# Altium schematic sheet Control.SchDoc
size Legal; SheetNumber: 1; SheetTotal: 1; SPICEModelCacheVIZEHTWB: <root> / <DocumentId>VIZEHTWB</DocumentId> / <CacheFrame Number="0"> / <Model Name="diode" Kind="MDL"> / <Text>*Default Diode / *Diode Pinout: A,K / .MODEL DIODE D()</Text> / </Model> / </CacheFrame> / </root>
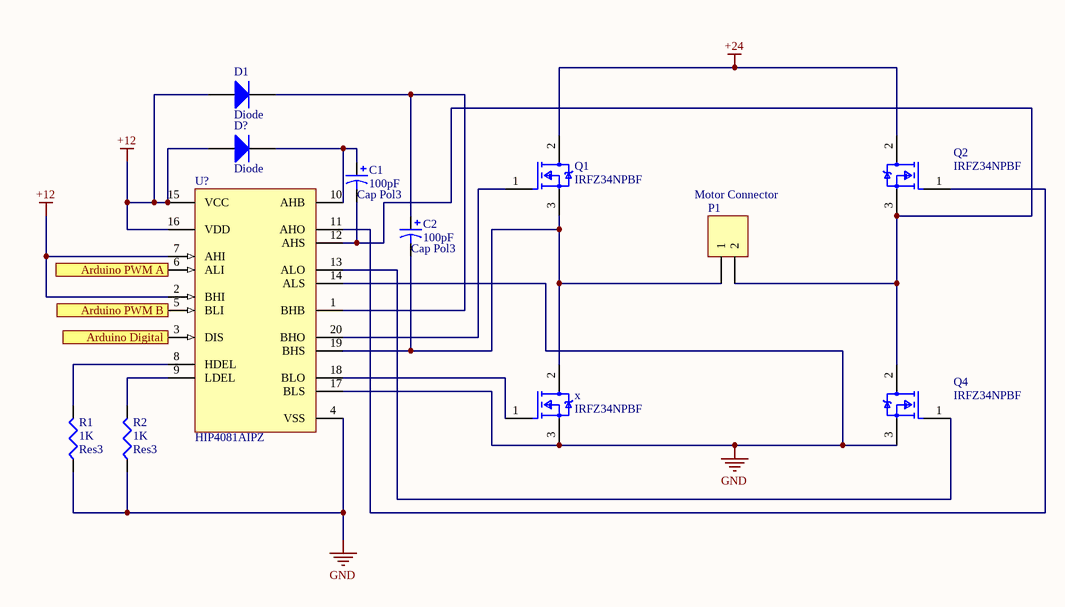
[diagram p0: Control.SchDoc]

## Parts
C1  Cap Pol3  value 100pF  [C0805]
C2  Cap Pol3  value 100pF  [C0805]
D1  Diode  [SMC]
D?  Diode  [SMC]
P1  Motor Connector  [HDR1X2]
Q1  IRFZ34NPBF  [FP-PG-TO220-3-MFG]
Q2  IRFZ34NPBF  [FP-PG-TO220-3-MFG]
Q4  IRFZ34NPBF  [FP-PG-TO220-3-MFG]
R1  Res3  value 1K  [J1-0603]
R2  Res3  value 1K  [J1-0603]
U?  HIP4081AIPZ  [DIP762W46P254L2590H533Q20_E20_3_N]
x  IRFZ34NPBF  [FP-PG-TO220-3-MFG]

## Ports
Arduino Digital (in), Arduino PWM A (in), Arduino PWM B (in)

## Nets
+12: D1.1(A) D?.1(A) U?.2(BHI) U?.7(AHI) U?.15(VCC) U?.16(VDD)
+24: Q1.2(DRAIN) Q2.2(DRAIN)
GND: Q4.3(SOURCE) R1.1 R2.1 U?.4(VSS) U?.14(ALS) U?.17(BLS) x.3(SOURCE)
Arduino Digital: U?.3(DIS) ; port Arduino Digital
Arduino PWM A: U?.6(ALI) ; port Arduino PWM A
Arduino PWM B: U?.5(BLI) ; port Arduino PWM B
NetC1_1: C1.1 D?.2(K) U?.10(AHB)
NetC1_2: C1.2 P1.2 Q2.3(SOURCE) Q4.2(DRAIN) U?.12(AHS)
NetC2_1: C2.1 D1.2(K) U?.1(BHB)
NetC2_2: C2.2 P1.1 Q1.3(SOURCE) U?.19(BHS) x.2(DRAIN)
NetQ1_1: Q1.1(GATE) U?.20(BHO)
NetQ2_1: Q2.1(GATE) U?.11(AHO)
NetQ4_1: Q4.1(GATE) U?.13(ALO)
NetR1_2: R1.2 U?.8(HDEL)
NetR2_2: R2.2 U?.9(LDEL)
NetU?_18: U?.18(BLO) x.1(GATE)

## Library data of the parts
C1 C2 = Cap Pol3: Polarized Capacitor (Surface Mount); Published: 8-Jun-2000; LatestRevisionDate: 29-May-2009; LatestRevisionNote: IPC-7351 Footprint Added.; PackageReference: C0805; Publisher: Altium Limited; PackageDescription: Chip Capacitor
D1 D? = Diode: Default Diode; Published: 8-Jun-2000; LatestRevisionDate: 17-Jul-2002; LatestRevisionNote: Re-released for DXP Platform.; PackageVersion: Sep-1996; PackageReference: SMC; Publisher: Altium Limited; PackageDescription: DO-214-AB/SMC; 2 C-Bend Leads; Body 7.9 x 5.9 mm, inc. leads (LxW); Code_JEDEC: DO-214-AB
P1 = Header 2: Header, 2-Pin; LatestRevisionDate: 17-Jul-2002; LatestRevisionNote: Re-released for DXP Platform.; Publisher: Altium Limited
Q1 Q2 Q4 x = CMP-32901-000547-1: MOSFET N-CH 55V 29A TO220AB; Rise Time: 49ns; Turn-On Delay Time: 7ns; Input Capacitance: 700pF; Drain to Source Resistance: 40mR; Turn-Off Delay Time: 31ns; Power Dissipation: 68W; Gate to Source Voltage (Vgs): 20V; Element Configuration: Single; Threshold Voltage: 4V; Packaging: Rail/Tube; Number of Pins: 3; Height: 0.6inch; Case/Package: TO-220; Min Operating Temperature: -55°C; Max Operating Temperature: 175°C; RoHS Compliant: Yes; Width: 0.185inch; Lead Free: Lead Free; Contact Plating: Tin; Drain to Source Breakdown Voltage: 55V; Length: 0.414inch; Mount: Through Hole; Max Power Dissipation: 68W; Halogen Free: Not Halogen Free; Max Dual Supply Voltage: 55V; Rds On Max: 40mR; Continuous Drain Current (ID): 29A; Drain to Source Voltage (Vdss): 55V; REACH SVHC: No SVHC
R1 R2 = Res3: Resistor; Published: 8-Jun-2000; LatestRevisionDate: 29-May-2009; LatestRevisionNote: IPC-7351 Footprint Added.; PackageReference: J1-0603; Publisher: Altium Limited; PackageDescription: Chip Resistor
U? = CMP-00572-88252434-2: Driver 2.5A 4-OUT Hi/Lo Side Full Brdg/Half Brdg Inv/Non-Inv Automotive 20-Pin PDIP Tube; Manufacturer Lifecycle Status: ACTIVE; Nominal Supply Current: 10.5mA; Max Supply Voltage: 15V; Pitch: 2.5mm; Number of Channels: 4; RAM Size: 32kB; Max Power Dissipation: 440mW; Turn-On Delay Time: 110ns; Fall Time: 10ns; Number of Drivers: 1; Output Voltage: 12.6V; Propagation Delay: 30ns; Overload Protection: Under Voltage; Min Supply Voltage: 9.5V; Turn-Off Delay Time: 90ns; Max Supply Current: 15.5mA; Switching Frequency: 1MHz; Number of Pins: 20; ComponentLink2Description: Datasheet URL; ComponentLink1Description: Manufacturer's Website; Max Output Current: 2.5A; Max Output Voltage: 15V; REACH SVHC: No; Packaging: Bulk; Min Operating Temperature: -40°C; Height: 3.94mm; ComponentLink2URL: https://octopart.com/cad-content/api/get-model-datasheet/15189/88252434; ComponentLink3Description: Manufacturer's Package Drawing; Lead Free: Lead Free; Export Control Classification Number (ECCN) Code: EAR99; HelpURL: https://octopart.com/cad-content/api/get-model-datasheet/15189/88252434; Max Operating Temperature: 85°C; Rise Time: 10ns; ComponentLink1URL: http://www.renesas.com; Width: 6.6mm; Number of Outputs: 4; ComponentLink3URL: https://www.renesas.com/en/document/psc/e203-20-lead-dual-line-plastic-packages; Lifecycle Status: Production; Length: 26.2mm; Output Current: 2.5A; Mount: Through Hole; Case/Package: PDIP; RoHS: Compliant